# Altium schematic sheet 04-MCU.SchDoc
size A3
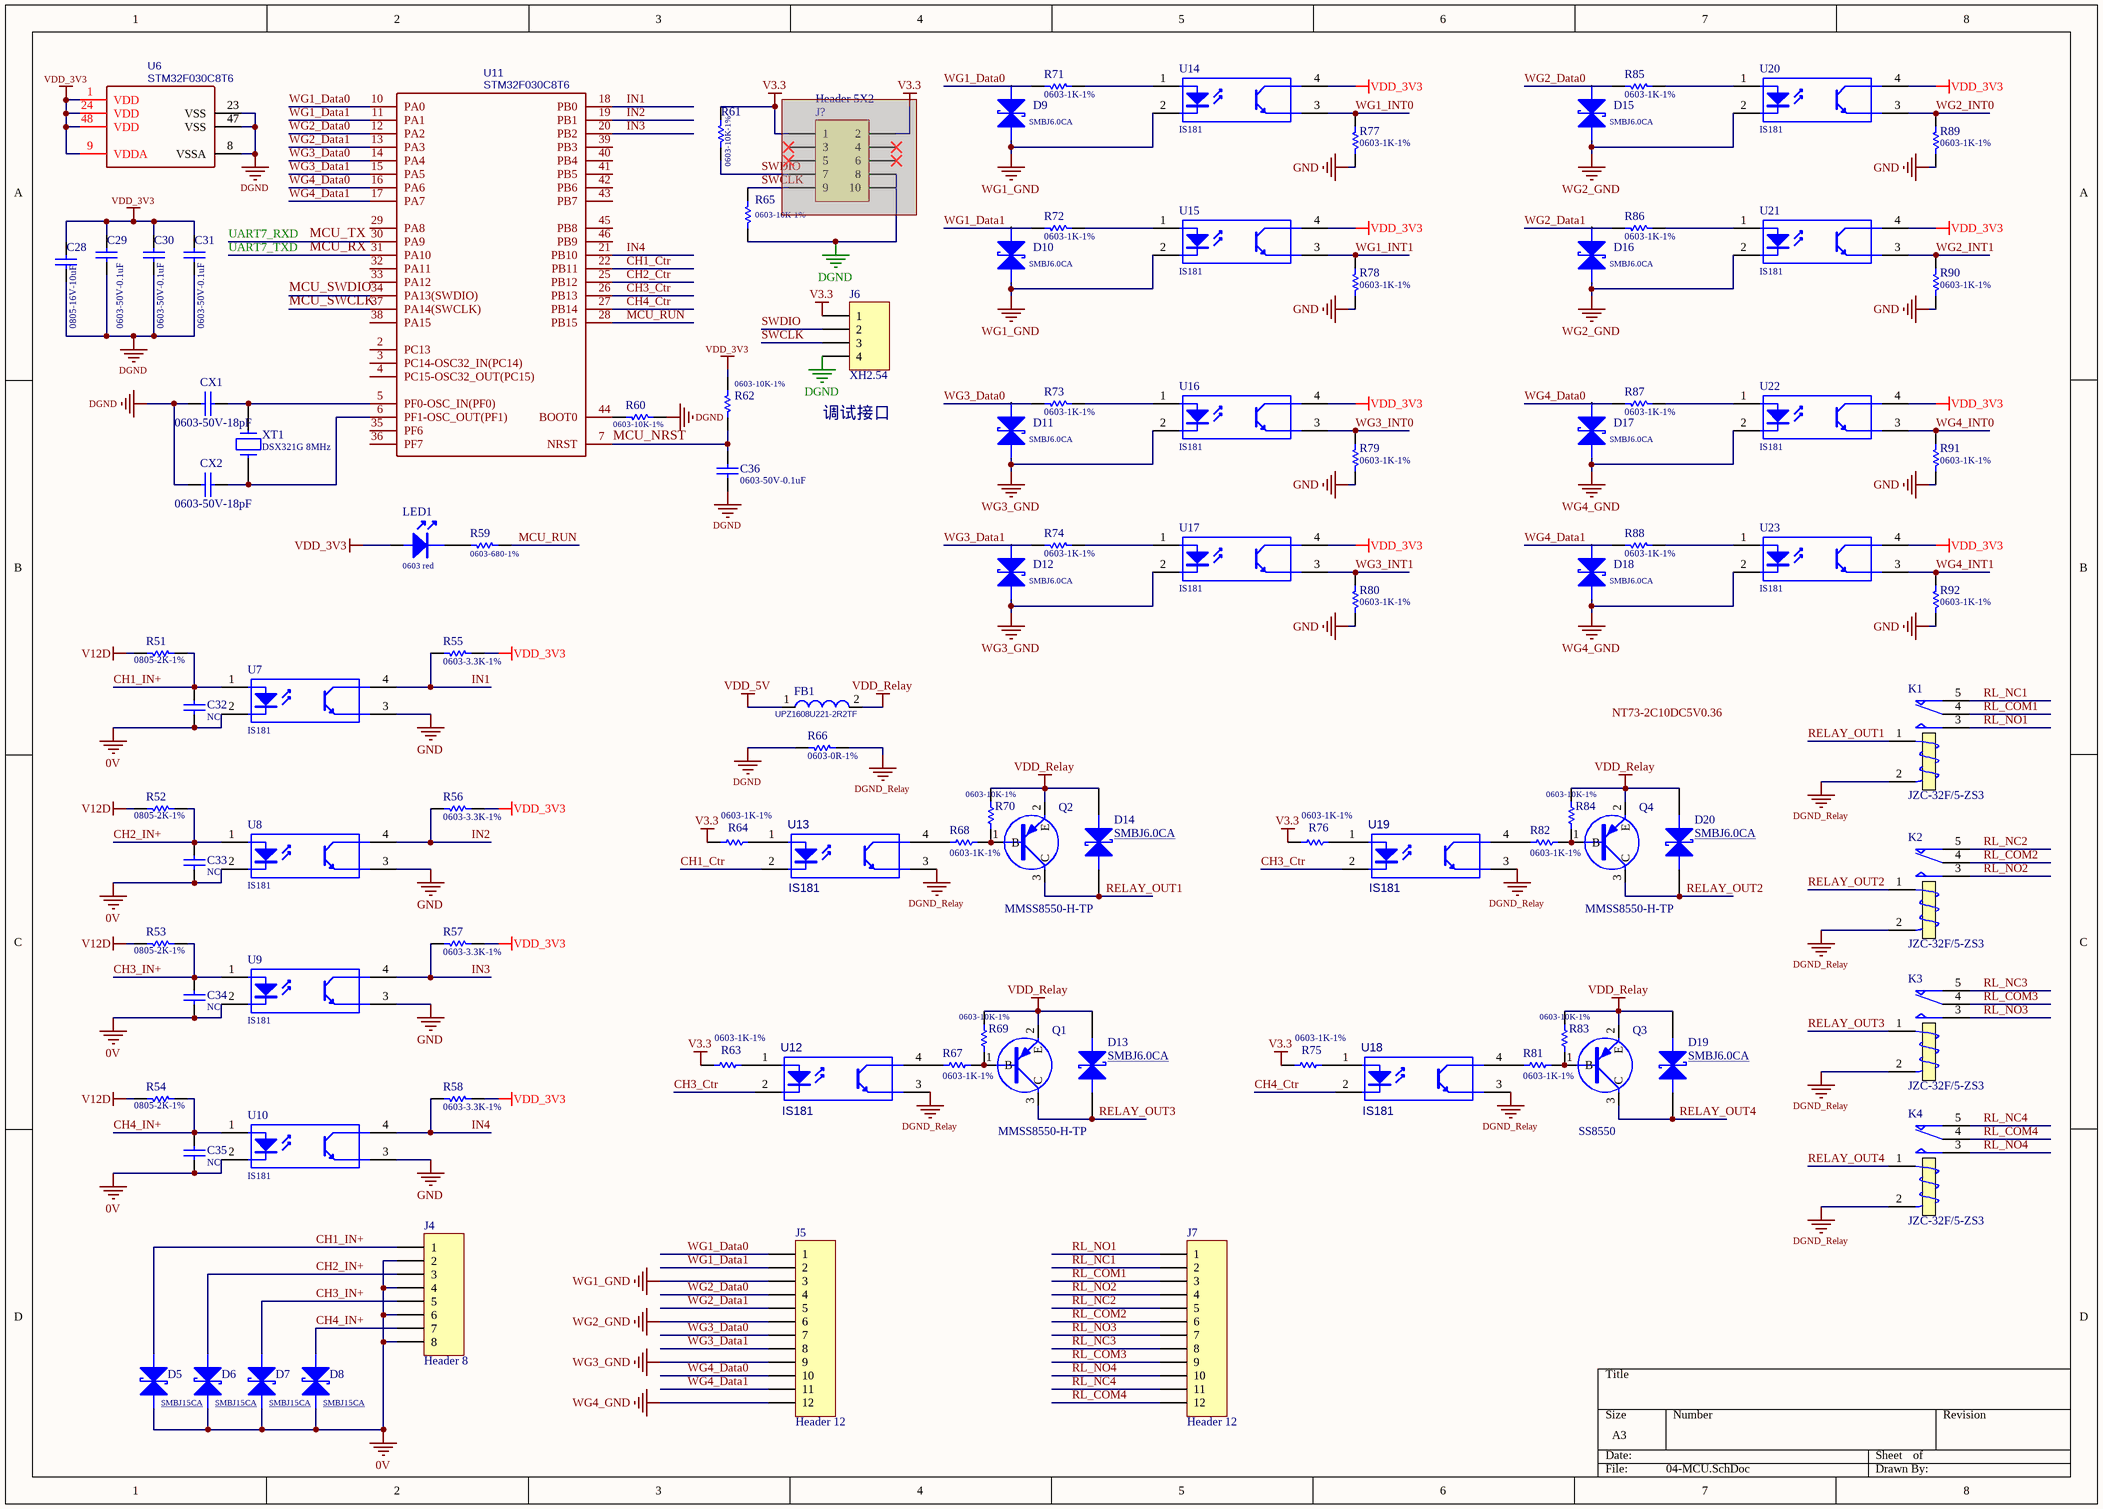
[diagram p0: 04-MCU.SchDoc]

## Parts
C28  0805-16V-10uF  [0805C]
C29  0603-50V-0.1uF  [0603C]
C30  0603-50V-0.1uF  [0603C]
C31  0603-50V-0.1uF  [0603C]
C32  NC  [0603C]
C33  NC  [0603C]
C34  NC  [0603C]
C35  NC  [0603C]
C36  0603-50V-0.1uF  [0603C]
CX1  0603-50V-18pF  [0603C]
CX2  0603-50V-18pF  [0603C]
D5  SMBJ15CA  [SMB-TVS]
D6  SMBJ15CA  [SMB-TVS]
D7  SMBJ15CA  [SMB-TVS]
D8  SMBJ15CA  [SMB-TVS]
D9  SMBJ6.0CA  [SMB-TVS]
D10  SMBJ6.0CA  [SMB-TVS]
D11  SMBJ6.0CA  [SMB-TVS]
D12  SMBJ6.0CA  [SMB-TVS]
D13  SMBJ6.0CA  [SMB-TVS]
D14  SMBJ6.0CA  [SMB-TVS]
D15  SMBJ6.0CA  [SMB-TVS]
D16  SMBJ6.0CA  [SMB-TVS]
D17  SMBJ6.0CA  [SMB-TVS]
D18  SMBJ6.0CA  [SMB-TVS]
D19  SMBJ6.0CA  [SMB-TVS]
D20  SMBJ6.0CA  [SMB-TVS]
FB1  UPZ1608U221-2R2TF  [0603L]
J4  Header 8  [KF2EDGR-5.08-8P]
J5  Header 12  [KF2EDGR-5.08-12P]
J6  XH2.54  [HDR1X4]
J7  Header 12  [KF2EDGR-5.08-12P]
J?  Header 5X2  [IDC-10-B]  (masked out: inside a compile mask, not in the netlist)
K1  JZC-32F/5-ZS3  [RELAY-HF_28]
K2  JZC-32F/5-ZS3  [RELAY-HF_28]
K3  JZC-32F/5-ZS3  [RELAY-HF_28]
K4  JZC-32F/5-ZS3  [RELAY-HF_28]
LED1  0603 red  [LED_1]
Q1  MMSS8550-H-TP  [SOT-23]
Q2  MMSS8550-H-TP  [SOT-23]
Q3  SS8550  [SOT-23]
Q4  MMSS8550-H-TP  [SOT-23]
R51  0805-2K-1%  [0805R]
R52  0805-2K-1%  [0805R]
R53  0805-2K-1%  [0805R]
R54  0805-2K-1%  [0805R]
R55  0603-3.3K-1%  [0603R]
R56  0603-3.3K-1%  [0603R]
R57  0603-3.3K-1%  [0603R]
R58  0603-3.3K-1%  [0603R]
R59  0603-680-1%  [0603R]
R60  0603-10K-1%  [0603R]
R61  0603-10K-1%  [0603R]
R62  0603-10K-1%  [0603R]
R63  0603-1K-1%  [0603R]
R64  0603-1K-1%  [0603R]
R65  0603-10K-1%  [0603R]
R66  0603-0R-1%  [0603R]
R67  0603-1K-1%  [0603R]
R68  0603-1K-1%  [0603R]
R69  0603-10K-1%  [0603R]
R70  0603-10K-1%  [0603R]
R71  0603-1K-1%  [0603R]
R72  0603-1K-1%  [0603R]
R73  0603-1K-1%  [0603R]
R74  0603-1K-1%  [0603R]
R75  0603-1K-1%  [0603R]
R76  0603-1K-1%  [0603R]
R77  0603-1K-1%  [0603R]
R78  0603-1K-1%  [0603R]
R79  0603-1K-1%  [0603R]
R80  0603-1K-1%  [0603R]
R81  0603-1K-1%  [0603R]
R82  0603-1K-1%  [0603R]
R83  0603-10K-1%  [0603R]
R84  0603-10K-1%  [0603R]
R85  0603-1K-1%  [0603R]
R86  0603-1K-1%  [0603R]
R87  0603-1K-1%  [0603R]
R88  0603-1K-1%  [0603R]
R89  0603-1K-1%  [0603R]
R90  0603-1K-1%  [0603R]
R91  0603-1K-1%  [0603R]
R92  0603-1K-1%  [0603R]
U6  STM32F030C8T6  [LQFP-48_7X7X05P]
U7  IS181  [SO-4-2.54]
U8  IS181  [SO-4-2.54]
U9  IS181  [SO-4-2.54]
U10  IS181  [SO-4-2.54]
U11  STM32F030C8T6  [LC-LQFP-48_7x7x05P]
U12  IS181  [SO-4-2.54]
U13  IS181  [SO-4-2.54]
U14  IS181  [SO-4-2.54]
U15  IS181  [SO-4-2.54]
U16  IS181  [SO-4-2.54]
U17  IS181  [SO-4-2.54]
U18  IS181  [SO-4-2.54]
U19  IS181  [SO-4-2.54]
U20  IS181  [SO-4-2.54]
U21  IS181  [SO-4-2.54]
U22  IS181  [SO-4-2.54]
U23  IS181  [SO-4-2.54]
XT1  DSX321G 8MHz  [LC-SMD-3225_4P]

## Nets
0V: C32.2 C33.2 C34.2 C35.2 D5.1(A) D6.1(A) D7.1(A) D8.1(A) J4.2 J4.4 J4.6 J4.8 U7.2(K) U8.2(K) U9.2(K) U10.2(K)
DGND: C28.2 C29.2 C30.2 C31.2 C36.2 CX1.1 CX2.1 J6.4 R60.1 R65.1 R66.1 U6.8(VSSA) U6.23(VSS) U6.47(VSS) XT1.2 XT1.4
DGND_Relay: K1.2(T2) K2.2(T2) K3.2(T2) K4.2(T2) R66.2 U12.3(C) U13.3(C) U18.3(C) U19.3(C)
GND: R77.2 R78.2 R79.2 R80.2 R89.2 R90.2 R91.2 R92.2 U7.3(E) U8.3(E) U9.3(E) U10.3(E)
V3.3: J6.1 R61.2 R63.1 R64.1 R75.1 R76.1
V12D: R51.2 R52.2 R53.2 R54.2
VDD_3V3: C28.1 C29.1 C30.1 C31.1 LED1.1 R55.2 R56.2 R57.2 R58.2 R62.2 U6.1(VDD) U6.9(VDDA) U6.24(VDD) U6.48(VDD) U14.4(C) U15.4(C) U16.4(C) U17.4(C) U20.4(C) U21.4(C) U22.4(C) U23.4(C)
VDD_5V: FB1.1
VDD_Relay: D13.1(A) D14.1(A) D19.1(A) D20.1(A) FB1.2 Q1.2(E) Q2.2(E) Q3.2(E) Q4.2(E) R69.2 R70.2 R83.2 R84.2
WG1_GND: D9.1(A) D10.1(A) J5.3 U14.2(K) U15.2(K)
WG2_GND: D15.1(A) D16.1(A) J5.6 U20.2(K) U21.2(K)
WG3_GND: D11.1(A) D12.1(A) J5.9 U16.2(K) U17.2(K)
WG4_GND: D17.1(A) D18.1(A) J5.12 U22.2(K) U23.2(K)
CH1_Ctr: U11.22(PB11) U13.2(K)
CH1_IN+: C32.1 D5.2(K) J4.1 R51.1 U7.1(A)
CH2_Ctr: U11.25(PB12)
CH2_IN+: C33.1 D6.2(K) J4.3 R52.1 U8.1(A)
CH3_Ctr: U11.26(PB13) U12.2(K) U19.2(K)
CH3_IN+: C34.1 D7.2(K) J4.5 R53.1 U9.1(A)
CH4_Ctr: U11.27(PB14) U18.2(K)
CH4_IN+: C35.1 D8.2(K) J4.7 R54.1 U10.1(A)
IN1: R55.1 U7.4(C) U11.18(PB0)
IN2: R56.1 U8.4(C) U11.19(PB1)
IN3: R57.1 U9.4(C) U11.20(PB2)
IN4: R58.1 U10.4(C) U11.21(PB10)
MCU_NRST: C36.1 R62.1 U11.7(NRST)
MCU_RUN: R59.1 U11.28(PB15)
MCU_RX: U11.31(PA10)  [also labelled UART7_TXD]
MCU_SWCLK: U11.37(PA14(SWCLK))
MCU_SWDIO: U11.34(PA13(SWDIO))
MCU_TX: U11.30(PA9)  [also labelled UART7_RXD]
RELAY_OUT1: D14.2(K) K1.1(T1) Q2.3(C)
RELAY_OUT2: D20.2(K) K2.1(T1) Q4.3(C)
RELAY_OUT3: D13.2(K) K3.1(T1) Q1.3(C)
RELAY_OUT4: D19.2(K) K4.1(T1) Q3.3(C)
RL_COM1: J7.3 K1.4(COM)
RL_COM2: J7.6 K2.4(COM)
RL_COM3: J7.9 K3.4(COM)
RL_COM4: J7.12 K4.4(COM)
RL_NC1: J7.2 K1.5(NC)
RL_NC2: J7.5 K2.5(NC)
RL_NC3: J7.8 K3.5(NC)
RL_NC4: J7.11 K4.5(NC)
RL_NO1: J7.1 K1.3(NO)
RL_NO2: J7.4 K2.3(NO)
RL_NO3: J7.7 K3.3(NO)
RL_NO4: J7.10 K4.3(NO)
SWCLK: J6.3 R65.2
SWDIO: J6.2 R61.1
WG1_Data0: J5.1 R71.1 U11.10(PA0)
WG1_Data1: J5.2 R72.1 U11.11(PA1)
WG1_INT0: R77.1 U14.3(E)
WG1_INT1: R78.1 U15.3(E)
WG2_Data0: J5.4 R85.1 U11.12(PA2)
WG2_Data1: J5.5 R86.1 U11.13(PA3)
WG2_INT0: R89.1 U20.3(E)
WG2_INT1: R90.1 U21.3(E)
WG3_Data0: J5.7 R73.1 U11.14(PA4)
WG3_Data1: J5.8 R74.1 U11.15(PA5)
WG3_INT0: R79.1 U16.3(E)
WG3_INT1: R80.1 U17.3(E)
WG4_Data0: J5.10 R87.1 U11.16(PA6)
WG4_Data1: J5.11 R88.1 U11.17(PA7)
WG4_INT0: R91.1 U22.3(E)
WG4_INT1: R92.1 U23.3(E)
NetCX1_2: CX1.2 U11.5(PF0-OSC_IN(PF0)) XT1.3
NetCX2_2: CX2.2 U11.6(PF1-OSC_OUT(PF1)) XT1.1
NetLED1_2: LED1.2 R59.2
NetQ1_1: Q1.1(B) R67.2 R69.1
NetQ2_1: Q2.1(B) R68.2 R70.1
NetQ3_1: Q3.1(B) R81.2 R83.1
NetQ4_1: Q4.1(B) R82.2 R84.1
NetR60_2: R60.2 U11.44(BOOT0)
NetR63_2: R63.2 U12.1(A)
NetR64_2: R64.2 U13.1(A)
NetR67_1: R67.1 U12.4(E)
NetR68_1: R68.1 U13.4(E)
NetR71_2: R71.2 U14.1(A)
NetR72_2: R72.2 U15.1(A)
NetR73_2: R73.2 U16.1(A)
NetR74_2: R74.2 U17.1(A)
NetR75_2: R75.2 U18.1(A)
NetR76_2: R76.2 U19.1(A)
NetR81_1: R81.1 U18.4(E)
NetR82_1: R82.1 U19.4(E)
NetR85_2: R85.2 U20.1(A)
NetR86_2: R86.2 U21.1(A)
NetR87_2: R87.2 U22.1(A)
NetR88_2: R88.2 U23.1(A)

Not connected (* = marked no-connect by the designer): D9 2(K); D10 2(K); D11 2(K); D12 2(K); D15 2(K); D16 2(K); D17 2(K); D18 2(K); U11 2(PC13) 3(PC14-OSC32_IN(PC14)) 4(PC15-OSC32_OUT(PC15)) 29(PA8) 32(PA11) 33(PA12) 35(PF6) 36(PF7) 38(PA15) 39(PB3) 40(PB4) 41(PB5) 42(PB6) 43(PB7) 45(PB8) 46(PB9)

## Notes on the sheet
- (near J6) 调试接口
- Labels drawn without touching a wire or pin: NT73-2C10DC5V0.36

## Library data of the parts
C28-C31 C36 = Cap: Capacitor; Value: 10nF; Published: 8-Jun-2000; Revision: July-2002: Re-released for DXP Platform.; Publisher: Altium Limited
C32-C35 = Cap: Capacitor; Value: 0603-50V-0.1uF; Published: 8-Jun-2000; Revision: July-2002: Re-released for DXP Platform.; Publisher: Altium Limited
CX1 CX2 = CAP: Capacitor; Value: 39pF
D5-D20 = TVSC
FB1 = FER_BEAD: CLASS: DISCRETE
J4 = Header 8: Header, 8-Pin; LatestRevisionDate: 17-Jul-2002; LatestRevisionNote: Re-released for DXP Platform.; Publisher: Altium Limited
J5 J7 = Header 12: Header, 12-Pin; LatestRevisionDate: 17-Jul-2002; LatestRevisionNote: Re-released for DXP Platform.; Publisher: Altium Limited
J6 = Header 4: Header, 4-Pin; LatestRevisionDate: 17-Jul-2002; LatestRevisionNote: Re-released for DXP Platform.; Publisher: Altium Limited
J? = Header 5X2: Header, 5-Pin, Dual row; LatestRevisionDate: 17-Jul-2002; LatestRevisionNote: Re-released for DXP Platform.; Publisher: Altium Limited
K1-K4 = Relay: SPDT Relay; Published: 8-Jun-2000; LatestRevisionDate: 17-Jul-2002; LatestRevisionNote: Re-released for DXP Platform.; PackageReference: MODULE5B; Publisher: Altium Limited
LED1 = LED: SY: POW
Q1-Q4 = PNP: PNP Transistor
R51-R58 R71-R74 R77-R80 R85-R92 = Res1: Resistor; Value: 10K; Published: 8-Jun-2000; LatestRevisionDate: 17-Jul-2002; LatestRevisionNote: Re-released for DXP Platform.; PackageReference: AXIAL-0.3; Publisher: Altium Limited
R59-R70 R75 R76 R81-R84 = Res1: Resistor; Value: 1K; Published: 8-Jun-2000; LatestRevisionDate: 17-Jul-2002; LatestRevisionNote: Re-released for DXP Platform.; PackageReference: AXIAL-0.3; Publisher: Altium Limited
U6 = (no symbol name): BOM_Manufacturer: ST; subpart_no: 2; tags: STM32; BOM_Supplier Part: C23922; BOM_Supplier: LCSC; BOM_Manufacturer Part: STM32F030C8T6; image: http://image.lceda.cn/szlcsc/C23922.jpg; spicePre: U
U7-U10 U14-U17 U20-U23 = OPTOISO1: Optoisolator
U11 = (no symbol name): BOM_Manufacturer: STMicroelectronics; BOM_Supplier: LCSC; BOM_Manufacturer Part: STM32F030C8T6; BOM_LCSC Assembly: Yes; image: //image.lceda.cn/szlcsc/C23922.jpg; BOM_Supplier Part: C23922; spicePre: U
U12 U13 U18 U19 = TLP521: 1.06.02.0011
XT1 = CRYSTAL: Value: 8MHz